# EAGLE design oilmon_intf_vr_photon (EAGLE 7.4.0)
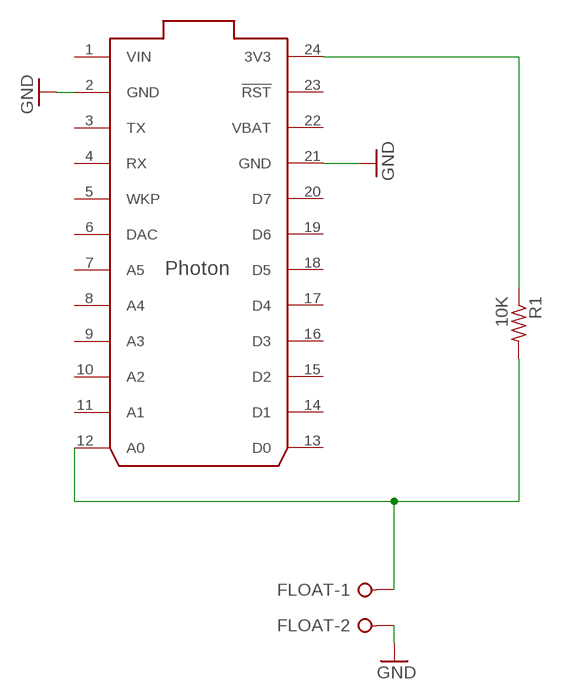
[diagram p0: schematic, sheet 1]

## Parts
FLOAT  W237-02P  [W237-132]
PHOTON  PHOTON_WITH_HEADERS  [PHOTON]
R1  10K  R-US_0207/10  [0207/10]

## Nets
GND: FLOAT.2 PHOTON.2(GND) PHOTON.21(GND)
N$1: PHOTON.24(3V3) R1.1
N$2: FLOAT.1 PHOTON.12(A0) R1.2
Unconnected: PHOTON.3(TX) PHOTON.4(RX) PHOTON.5(WKP) PHOTON.6(DAC) PHOTON.7(A5) PHOTON.8(A4) PHOTON.9(A3) PHOTON.10(A2) PHOTON.11(A1) PHOTON.13(D0) PHOTON.14(D1) PHOTON.15(D2) PHOTON.16(D3) PHOTON.17(D4) PHOTON.18(D5) PHOTON.19(D6) PHOTON.20(D7) PHOTON.23(!RST)

## Power pins joined to a net without a drawn wire
VBAT: PHOTON.22(VBAT)
VIN: PHOTON.1(VIN)

## Library data of the parts
FLOAT = con-wago-508:W237-02P: WAGO SREW CLAMP; OC_FARNELL: unknown; OC_NEWARK: unknown
PHOTON = Spark:PHOTON
R1 = rcl:R-US_: RESISTOR, American symbol

## Net classes
0 default: width 0.305 mm, drill 0.508 mm, clearance 0.254 mm

## Board
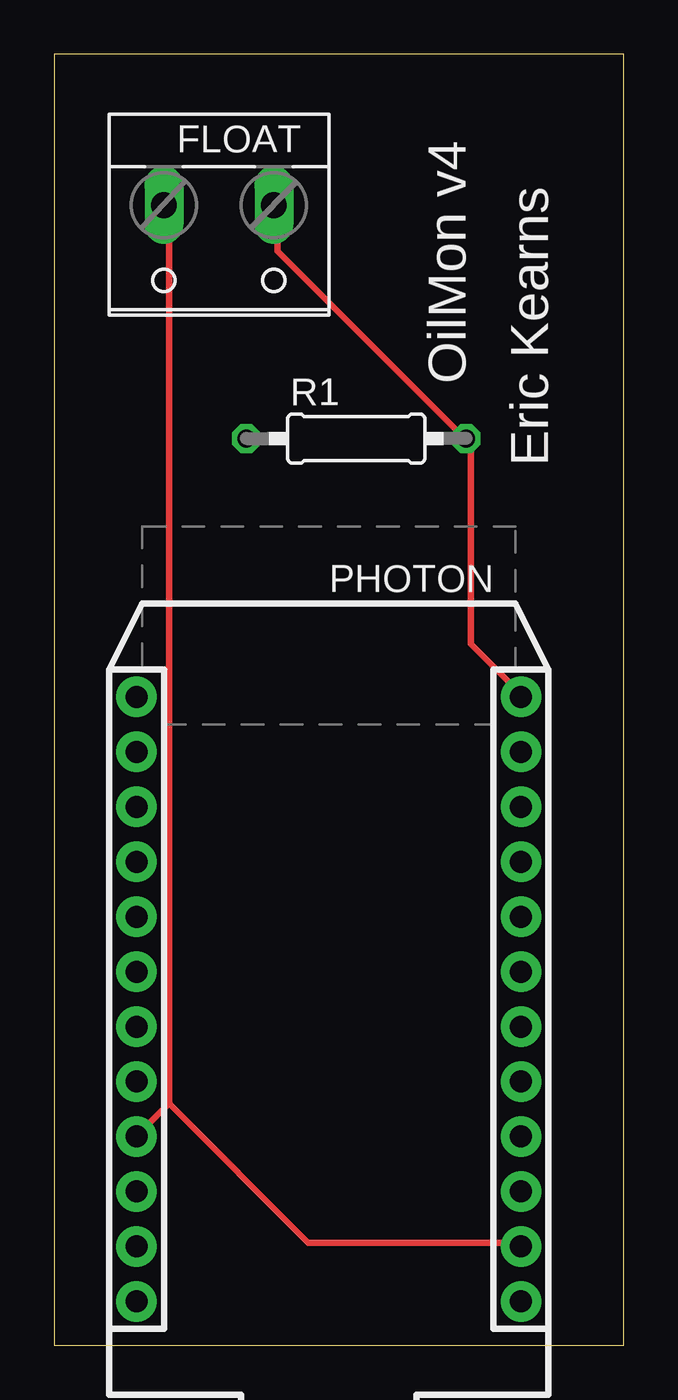
[diagram p1: board, top side]
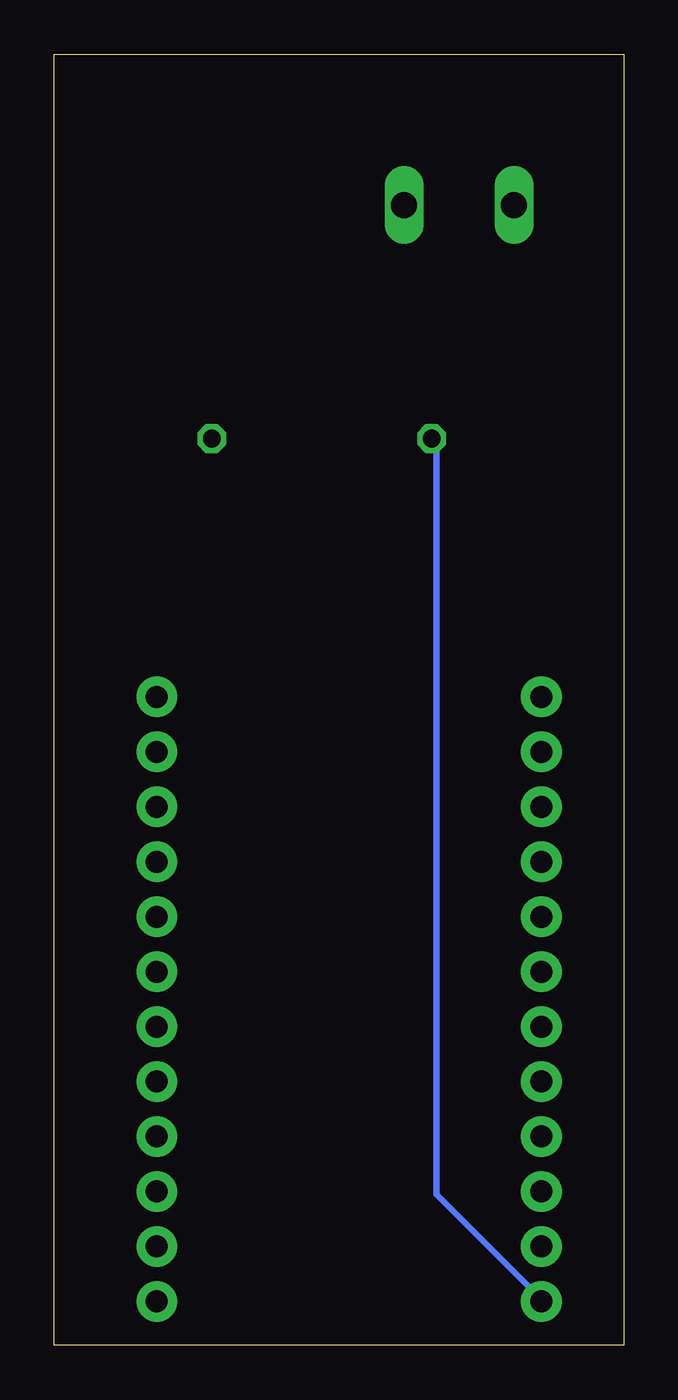
[diagram p2: board, bottom side, seen from below]

Size 26.34 x 59.68 mm. Coordinates in mm from the lower left corner, seen from the top.
Outline: 0,0 26.34,0 26.34,59.68 0,59.68 0,0
Copper layers (1*16): Top 0.035mm / dielectric 1.5mm / Bottom 0.035mm
Design rules "default": minimum track width 10mil, minimum drill 24mil, track to track 8mil, track to pad 8mil, pad to pad 8mil, via to via 8mil, smd to smd 8mil, copper to edge 40mil, drill to drill 8mil, minimum pad ring 10mil, minimum via ring 8mil, stop-mask expansion 4mil, vias tented up to drill 0mil, thermal gap 10mil
tKeepout: area 3.8,27.9 to 21.6,38.1
bKeepout: area 3.8,27.9 to 21.6,38.1

### Footprints (pad centres in the part's own frame; a part is rotated, then mirrored left to right if it is on the bottom)
W237-132 = drill 1.194 long: 1 -2.54,-0.635; 2 2.54,-0.635
PHOTON = drill 1.016 pad 1.88: 1 1.27,32.258; 2 1.27,29.718; 3 1.27,27.178; 4 1.27,24.638; 5 1.27,22.098; 6 1.27,19.558; 7 1.27,17.018; 8 1.27,14.478; 9 1.27,11.938; 10 1.27,9.398; 11 1.27,6.858; 12 1.27,4.318; 13 19.05,4.318; 14 19.05,6.858; 15 19.05,9.398; 16 19.05,11.938; 17 19.05,14.478; 18 19.05,17.018; 19 19.05,19.558; 20 19.05,22.098; 21 19.05,24.638; 22 19.05,27.178; 23 19.05,29.718; 24 19.05,32.258
0207/10 = drill 0.813 octagon: 1 -5.08,0; 2 5.08,0

### Placement (x,y rotation side)
FLOAT  7.62,52.07 180 top
PHOTON  22.86,34.29 180 top
R1  13.97,41.91 0 top

### Tracks (layer width: path | path; a pad name or v marks a point on that pad's centre or on a via)
GND
  Top 0.305: 5.31,11.18 5.31,52.53 FLOAT.2 | 5.31,11.18 3.91,9.78 PHOTON.21 | 5.31,11.18 11.73,4.75 21.51,4.75 PHOTON.2
N$1
  Bottom 0.305: R1.1 8.66,41.91 8.66,6.99 3.91,2.23 PHOTON.24
N$2
  Top 0.305: PHOTON.12 21.51,30.18 19.28,32.41 19.28,41.91 R1.2 19,41.91 10.34,50.57 10.34,52.53 FLOAT.1

### Text on the board
_tsilk: OilMon v4 | Eric Kearns